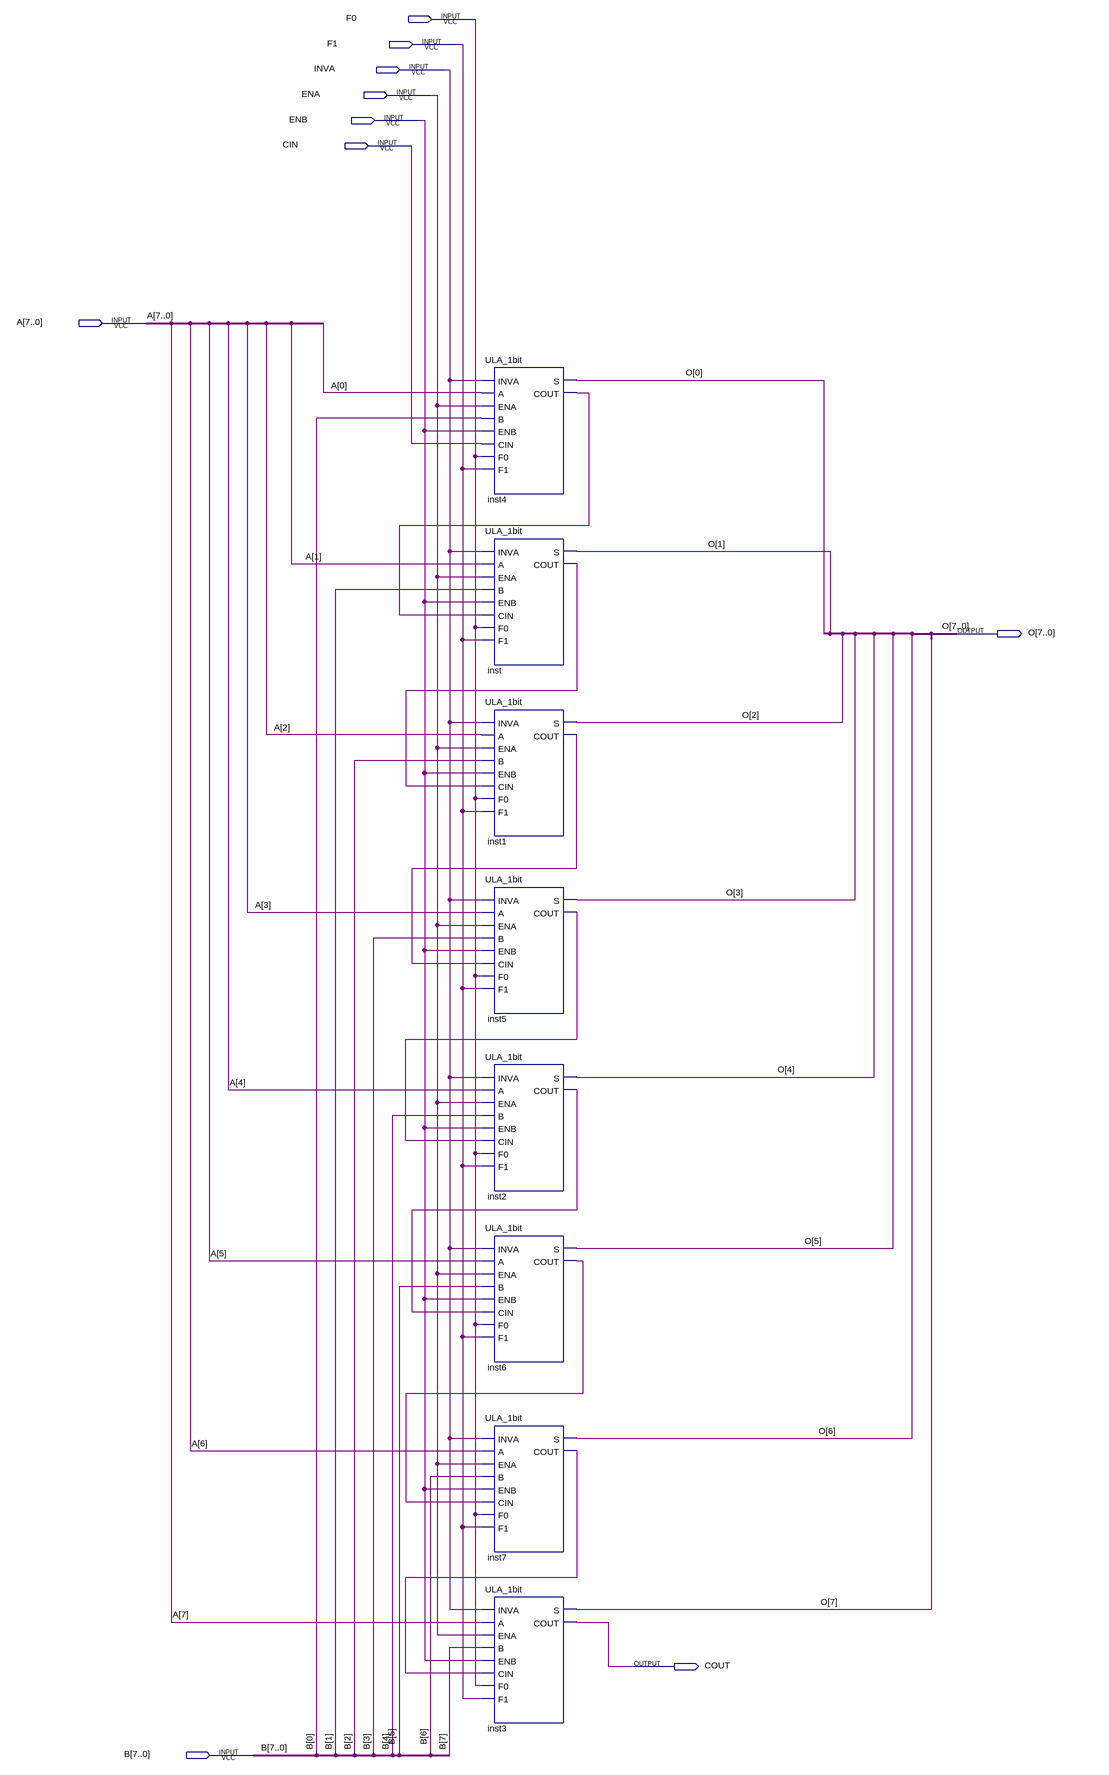
[diagram p0: schematic sheet]
// Quartus schematic ULA_8bits.bdf as structural Verilog: 8 symbols, 10 pins
module ULA_8bits (
  input  F0,
  input  F1,
  input  INVA,
  input  ENA,
  input  ENB,
  input  CIN,
  input  [7:0] A,
  input  [7:0] B,
  output [7:0] O,
  output COUT
);

  wire inst1_cout, inst2_cout, inst4_cout, inst5_cout, inst6_cout, inst7_cout, inst_cout;

  ULA_1bit inst4 (
    .INVA(INVA), .A(A[0]), .ENA(ENA), .B(B[0]), .ENB(ENB), .CIN(CIN), .F0(F0), .F1(F1), .S(O[0]),
    .COUT(inst4_cout));
  ULA_1bit inst (
    .INVA(INVA), .A(A[1]), .ENA(ENA), .B(B[1]), .ENB(ENB), .CIN(inst4_cout), .F0(F0), .F1(F1), .S(O[1]),
    .COUT(inst_cout));
  ULA_1bit inst1 (
    .INVA(INVA), .A(A[2]), .ENA(ENA), .B(B[2]), .ENB(ENB), .CIN(inst_cout), .F0(F0), .F1(F1), .S(O[2]),
    .COUT(inst1_cout));
  ULA_1bit inst5 (
    .INVA(INVA), .A(A[3]), .ENA(ENA), .B(B[3]), .ENB(ENB), .CIN(inst1_cout), .F0(F0), .F1(F1), .S(O[3]),
    .COUT(inst5_cout));
  ULA_1bit inst2 (
    .INVA(INVA), .A(A[4]), .ENA(ENA), .B(B[4]), .ENB(ENB), .CIN(inst5_cout), .F0(F0), .F1(F1), .S(O[4]),
    .COUT(inst2_cout));
  ULA_1bit inst6 (
    .INVA(INVA), .A(A[5]), .ENA(ENA), .B(B[5]), .ENB(ENB), .CIN(inst2_cout), .F0(F0), .F1(F1), .S(O[5]),
    .COUT(inst6_cout));
  ULA_1bit inst7 (
    .INVA(INVA), .A(A[6]), .ENA(ENA), .B(B[6]), .ENB(ENB), .CIN(inst6_cout), .F0(F0), .F1(F1), .S(O[6]),
    .COUT(inst7_cout));
  ULA_1bit inst3 (
    .INVA(INVA), .A(A[7]), .ENA(ENA), .B(B[7]), .ENB(ENB), .CIN(inst7_cout), .F0(F0), .F1(F1), .S(O[7]),
    .COUT(COUT));
endmodule
